# Altium schematic sheet relay.SchDoc
size A4; SheetNumber: 4; SheetTotal: 4
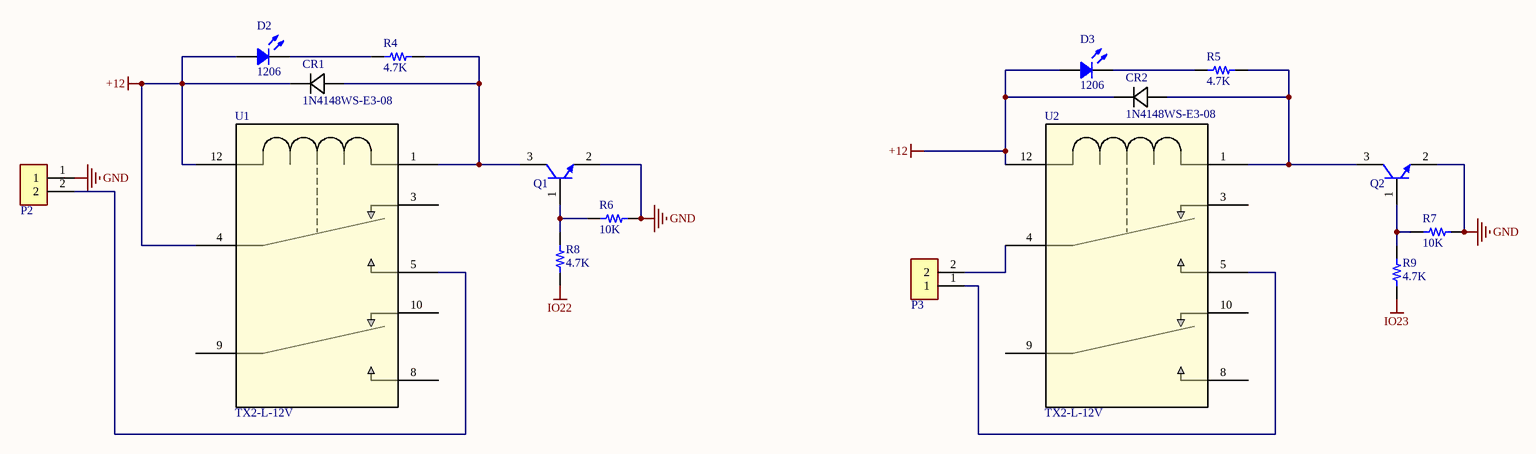
[diagram p0: relay.SchDoc]

## Parts
CR1  1N4148WS-E3-08  [CR_WS-E3-08_VIS]
CR2  1N4148WS-E3-08  [CR_WS-E3-08_VIS]
D2  1206  [LED 1206_3216 YELLOW]
D3  1206  [LED 1206_3216 YELLOW]
P2  282837-2  [TE_282837-2]  (value not drawn)
P3  282837-2  [TE_282837-2]  (value not drawn)
Q1  BC817-25,215  [NEXPERIA SOT-23-3]  (value not drawn)
Q2  BC817-25,215  [NEXPERIA SOT-23-3]  (value not drawn)
R4  4.7K  [RES 1206_3216]
R5  4.7K  [RES 1206_3216]
R6  10K  [RES 1206_3216]
R7  10K  [RES 1206_3216]
R8  4.7K  [RES 1206_3216]
R9  4.7K  [RES 1206_3216]
U1  TX2-L-12V  [RELAY_TX2_PAN]
U2  TX2-L-12V  [RELAY_TX2_PAN]

## Nets
+12: CR1.1 CR2.1 D2.1 D3.1 U1.4 U1.12 U2.12
GND: P2.1 Q1.2(E) Q2.2(E) R6.2 R7.2
IO22: R8.1
IO23: R9.1
NetCR1_2: CR1.2 Q1.3(C) R4.1 U1.1
NetCR2_2: CR2.2 Q2.3(C) R5.1 U2.1
NetD2_2: D2.2 R4.2
NetD3_2: D3.2 R5.2
NetP2_2: P2.2 U1.5
NetP3_1: P3.1 U2.5
NetP3_2: P3.2 U2.4
NetQ1_1: Q1.1(B) R6.1 R8.2
NetQ2_1: Q2.1(B) R7.1 R9.2

Not connected (* = marked no-connect by the designer): U1 3(5) 8(3) 9(6) 10(8); U2 3(5) 8(3) 9(6) 10(8)

## Library data of the parts
CR1 CR2 = 1N4148WS-E3-08: No Description Available; Mfr_Name: Vishay
D2 D3 = 25-21UYC/S530-A2/TR8: LED YELLOW CLEAR 2SMD; Manufacturer: Everlight Electronics Co Ltd; Configuration: Standard; Current - Test: 20mA; Lens Color: Colorless; Lens Size: 1.10mm Dia; Lens Style: Round with Domed Top; Millicandela Rating: 45mcd; Viewing Angle: 60°; Voltage - Forward (Vf) (Typ): 2V; Wavelength - Dominant: 589nm; Wavelength - Peak: 591nm; Part Number: 25-21UYC/S530-A2/TR8; Color: Yellow; ComponentLink1Description: Datasheet; ComponentLink1URL: //media.digikey.com/pdf/Data%20Sheets/Everlight%20PDFs/25-21UYC-S530-A2-TR8_V6_11-12-18.pdf; ComponentLink2Description: DigiKey Link; ComponentLink2URL: https://www.digikey.com/en/products/detail/everlight-electronics-co-ltd/25-21UYC-S530-A2-TR8/8535289; Device Package: 1206 (3216 Metric); Height (Max): 1.20mm; LastUpdated: 3.06.2024 20:01:38; Lens Transparency: Clear; Lifecycle Status: Active; Minimum Order: 1; Mounting Type: Surface Mount; Package / Case: 1206 (3216 Metric); Packaging: TapeAndReel; PartId: 2; Part Status: Active; Price: 0.08; Series: -; Size / Dimension: 3.20mm L x 1.60mm W; Supplier 1: DigiKey; Supplier Part Number 1: 1080-1595-1-ND; Supplier Device Package: 2-SMD; Value: Yellow
P2 P3 = 282837-2: Ð Ð°Ð·ÑŠÐµÐ¼Ð½Ñ‹Ðµ ÐºÐ»ÐµÐ¼Ð¼Ð½Ñ‹Ðµ ÐºÐ¾Ð»Ð¾Ð´ÐºÐ¸ Ð Ð¾Ð·ÐµÑ‚ÐºÐ° 2 Ð¿Ð¾Ð»Ð¾Ð¶ÐµÐ½Ð¸Ñ 5,08 Ð¼Ð¼ ÐŸÑ€Ð¸Ð¿Ð¾Ð¹ Ð¿Ñ€ÑÐ¼Ð¾Ð¹ Ñ‡ÐµÑ€ÐµÐ· Ð¾Ñ‚Ð²ÐµÑ€ÑÑ‚Ð¸Ðµ 13,5 Ð / ÐºÐ¾Ð½Ñ‚Ð°ÐºÑ‚; MF: TE Connectivity; SnapEDA_Link: https://www.snapeda.com/parts/282837-2/TE+Connectivity+AMP+Connectors/view-part/?ref=snap; Price: None; Check_prices: https://www.snapeda.com/parts/282837-2/TE+Connectivity+AMP+Connectors/view-part/?ref=eda; Purchase-URL: https://pricing.snapeda.com/search/part/282837-2/?ref=eda; MP: 282837-2; Value: *; Availability: In Stock; Package: None
Q1 Q2 = BC817-25,215: TRANS NPN 45V 0.5A TO236AB; Manufacturer: Nexperia USA Inc.; Current - Collector Cutoff (Max): 100nA (ICBO); Current - Collector (Ic) (Max): 500 mA; DC Current Gain (hFE) (Min) @ Ic, Vce: 160 @ 100mA, 1V; Frequency - Transition: 100MHz; Power - Max: 250 mW; Vce Saturation (Max) @ Ib, Ic: 700mV @ 50mA, 500mA; Part Number: BC817-25,215; ComponentLink1Description: Datasheet; ComponentLink1URL: https://assets.nexperia.com/documents/data-sheet/BC817_SER.pdf; ComponentLink2Description: DigiKey Link; ComponentLink2URL: https://www.digikey.com/en/products/detail/nexperia-usa-inc/BC817-25-215/763234; LastUpdated: 3.06.2024 20:24:20; Lifecycle Status: Active; Minimum Order: 1; Mounting Type: Surface Mount; Operating Temperature: 150°C (TJ); Package / Case: TO-236-3, SC-59, SOT-23-3; Packaging: TapeAndReel; PartId: 319; Part Status: Active; Price: 0.02; Series: -; Supplier 1: DigiKey; Supplier Part Number 1: 1727-2918-1-ND; Supplier Device Package: TO-236AB; Transistor Type: NPN; Voltage - Collector Emitter Breakdown (Max): 45 V
R4-R9 = CRCW120661K9FKEA: RES SMD 61.9K OHM 1% 1/4W 1206; Manufacturer: Vishay Dale; Power (Watts): 0.25W, 1/4W; Resistance: 61.9 kOhms; Temperature Coefficient: ±100ppm/°C; Value: 61.9 kOhms; Part Number: CRCW120661K9FKEA; ComponentLink1Description: Datasheet; ComponentLink1URL: http://www.vishay.com/docs/20035/dcrcwe3.pdf; ComponentLink2Description: DigiKey Link; ComponentLink2URL: https://www.digikey.com/en/products/detail/vishay-dale/CRCW120661K9FKEA/1176848; Composition: Thick Film; Device Package: 1206 (3216 Metric); Features: Automotive AEC-Q200; Height - Seated (Max): 0.024" (0.60mm); LastUpdated: 9.02.2024 20:54:45; Lifecycle Status: Active; Minimum Order: 1; Number of Terminations: 2; Operating Temperature: -55°C ~ 155°C; Package / Case: 1206 (3216 Metric); Packaging: TapeAndReel; PartId: 26923; Part Status: Active; Price: 0.01; Ratings: AEC-Q200; Series: CRCW; Size / Dimension: 0.126" L x 0.063" W (3.20mm x 1.60mm); Supplier 1: DigiKey; Supplier Part Number 1: 541-61.9KFCT-ND; Supplier Device Package: 1206; Tolerance: ±1%
U1 U2 = TX2-L-12V: No Description Available; Mfr_Name: Panasonic; Digi-Key_Part_Number_1: TX2-L-12V-ND; RefDes: RefDes; Type: Type